# Altium schematic sheet Tone_board.SchDoc
size B
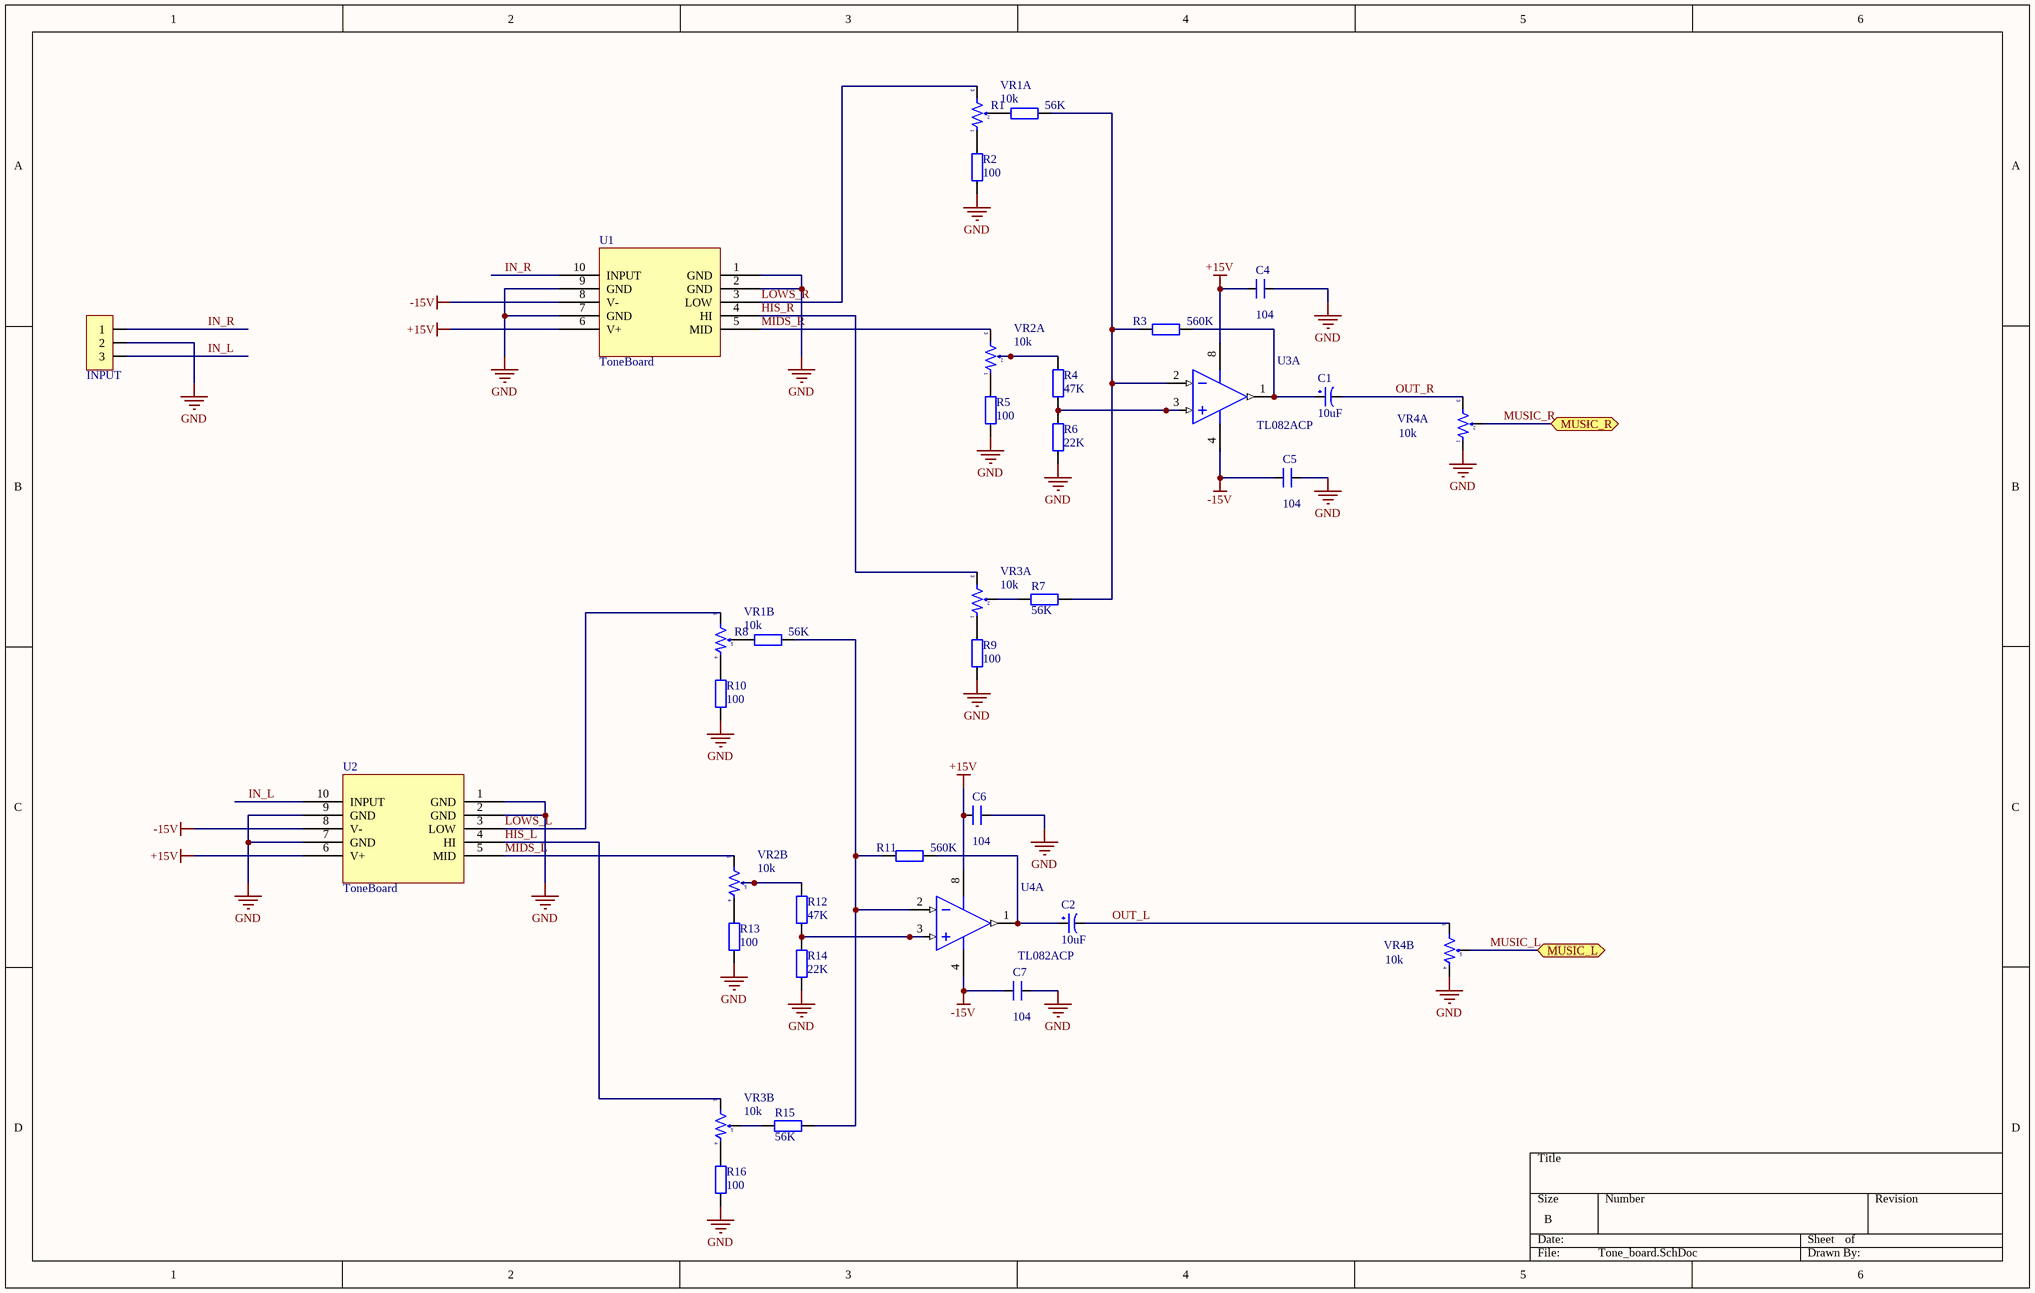
[diagram p0: Tone_board.SchDoc]

## Parts
C1  10uF  [CAP5x12]
C2  10uF  [CAP5x12]
C4  104  [TU_GOM(104-->105pF)]
C5  104  [TU_GOM(104-->105pF)]
C6  104  [TU_GOM(104-->105pF)]
C7  104  [TU_GOM(104-->105pF)]
INPUT  Header 3_MH  [HEADER 3]  (value not drawn)
R1  56K  [TRO_VACH_ 1/4W]
R2  100  [TRO_VACH_ 1/4W]
R3  560K  [TRO_VACH_ 1/4W]
R4  47K  [TRO_VACH_ 1/4W]
R5  100  [TRO_VACH_ 1/4W]
R6  22K  [TRO_VACH_ 1/4W]
R7  56K  [TRO_VACH_ 1/4W]
R8  56K  [TRO_VACH_ 1/4W]
R9  100  [TRO_VACH_ 1/4W]
R10  100  [TRO_VACH_ 1/4W]
R11  560K  [TRO_VACH_ 1/4W]
R12  47K  [TRO_VACH_ 1/4W]
R13  100  [TRO_VACH_ 1/4W]
R14  22K  [TRO_VACH_ 1/4W]
R15  56K  [TRO_VACH_ 1/4W]
R16  100  [TRO_VACH_ 1/4W]
U1  ToneBoard  [ToneBoard]
U2  ToneBoard  [ToneBoard]
U3  TL082ACP  [DIP8]  (part A of 2)
U4  TL082ACP  [DIP8]  (part A of 2)
VR1  10k  [9011]  (parts A,B of 2)
VR2  10k  [9011]  (parts A,B of 2)
VR3  10k  [9011]  (parts A,B of 2)
VR4  10k  [9011]  (parts A,B of 2)

## Ports
MUSIC_L, MUSIC_R

## Nets
+15V: C4.1 C6.1 U1.6(V+) U2.6(V+) U3.8(V+) U4.8(V+)
-15V: C5.1 C7.1 U1.8(V-) U2.8(V-) U3.4(V-) U4.4(V-)
GND: C4.2 C5.2 C6.2 C7.2 INPUT.2 R2.1 R5.1 R6.1 R9.1 R10.1 R13.1 R14.1 R16.1 U1.1(GND) U1.2(GND) U1.7(GND) U1.9(GND) U2.1(GND) U2.2(GND) U2.7(GND) U2.9(GND) VR4.1 VR4.4
HIS_L: U2.4(HI) VR3.6
HIS_R: U1.4(HI) VR3.3
IN_L: INPUT.3 U2.10(INPUT)
IN_R: INPUT.1 U1.10(INPUT)
LOWS_L: U2.3(LOW) VR1.6
LOWS_R: U1.3(LOW) VR1.3
MIDS_L: U2.5(MID) VR2.6
MIDS_R: U1.5(MID) VR2.3
MUSIC_L: VR4.5 ; port MUSIC_L
MUSIC_R: VR4.2 ; port MUSIC_R
OUT_L: C2.2 VR4.6
OUT_R: C1.2 VR4.3
NetC1_1: C1.1 R3.1 U3.1(OUT)
NetC2_1: C2.1 R11.1 U4.1(OUT)
NetR1_1: R1.1 R3.2 R7.1 U3.2(IN-)
NetR1_2: R1.2 VR1.2
NetR2_2: R2.2 VR1.1
NetR4_1: R4.1 R6.2 U3.3(IN+)
NetR4_2: R4.2 VR2.2
NetR5_2: R5.2 VR2.1
NetR7_2: R7.2 VR3.2
NetR8_1: R8.1 R11.2 R15.1 U4.2(IN-)
NetR8_2: R8.2 VR1.5
NetR9_2: R9.2 VR3.1
NetR10_2: R10.2 VR1.4
NetR12_1: R12.1 R14.2 U4.3(IN+)
NetR12_2: R12.2 VR2.5
NetR13_2: R13.2 VR2.4
NetR15_2: R15.2 VR3.5
NetR16_2: R16.2 VR3.4

## Library data of the parts
C1 C2 = TU_HOA_4.7uF_100V_MH: Value: 4700uF/50V
C4-C7 = TU_MICA_ 104 100V(2A104J)_MH: Value: 0.1uF
INPUT = Header 3_MH: Header 3P XH2.54 thẳng
R1 R3-R16 = TRO_VACH_1/2W_MH: Resistor; Value: 1K; Published: 8-Jun-2000; LatestRevisionDate: 17-Jul-2002; LatestRevisionNote: Re-released for DXP Platform.; Publisher: Altium Limited
R2 = TRO_VACH_1/2W_MH: 100 Ohms ±1% 0.25W, 1/4W Through Hole Resistor Axial Metal Film; Manufacturer Part Number: MFR-25FBF52-100R; Value: 1K; Published: 8-Jun-2000; LatestRevisionNote: Re-released for DXP Platform.; Publisher: Altium Limited
U3 U4 = TL082ACP: JFET-Input Operational Amplifier; Published: 17-Jul-2002; LatestRevisionDate: 06-Jun-2005; LatestRevisionNote: Stylized 3D Model Added.; DatasheetVersion: 1988; PackageReference: 626-05; Publisher: Altium Limited; PackageDescription: DIP; 8 Leads; Row Spacing 7.62 mm; Pitch 2.54 mm; ComponentLink1Description: Manufacturer Link; ComponentLink1URL: http://www.onsemi.com/site/products/parametrics/0,4446,251,00.html
VR1-VR4 = Triet Ap Doi 10k_MH: Triet Ap Doi 10k